# Altium schematic sheet top.SchDoc
size A4
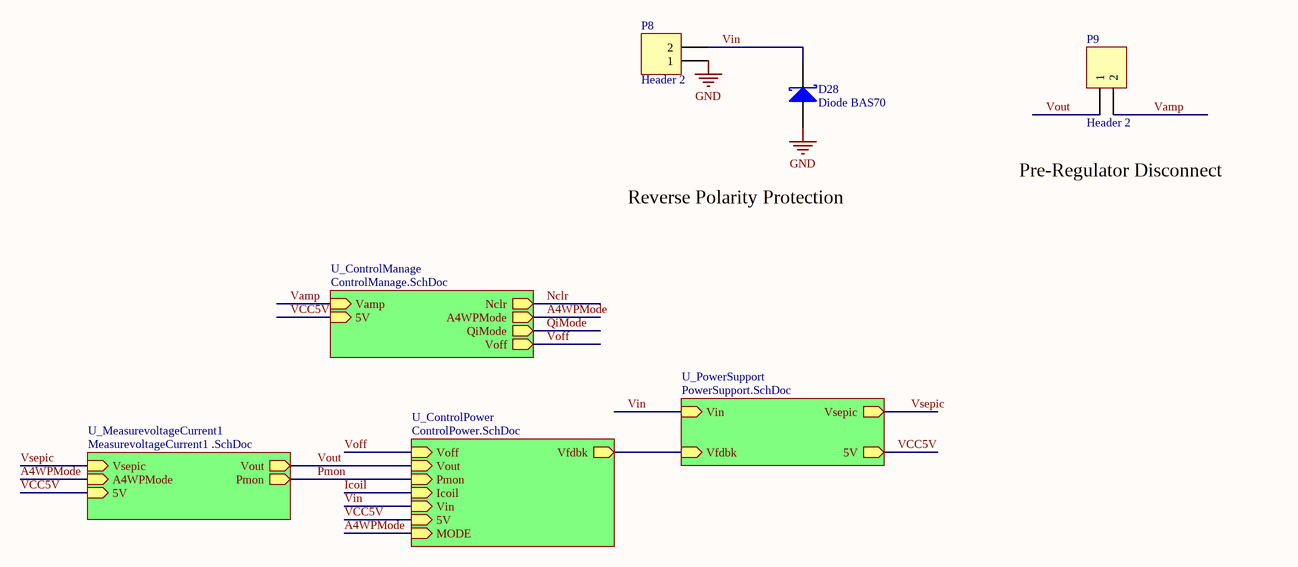
[diagram p0: top.SchDoc]

## Parts
D28  Diode BAS70  [SMA]
P8  Header 2  [HDR1X2]
P9  Header 2  [HDR1X2]

## Sub-sheets
U_ControlManage = ControlManage.SchDoc: Nclr (out), Vamp (in), A4WPMode (out), QiMode (out), 5V (in), Voff (out)
U_ControlPower = ControlPower.SchDoc: Voff (in), Vout (in), Pmon (in), Icoil (in), Vfdbk (out), Vin (in), 5V (in), MODE (in)
U_MeasurevoltageCurrent1  = MeasurevoltageCurrent1 .SchDoc: Vout (out), Vsepic (in), A4WPMode (in), Pmon (out), 5V (in)
U_PowerSupport = PowerSupport.SchDoc: Vsepic (out), 5V (out), Vin (in), Vfdbk (in)

## Nets
GND: D28.1(A) P8.1
A4WPMode: sheet U_ControlManage/A4WPMode, sheet U_ControlPower/MODE, sheet U_MeasurevoltageCurrent1 /A4WPMode
Icoil: sheet U_ControlPower/Icoil
Nclr: sheet U_ControlManage/Nclr
Pmon: sheet U_ControlPower/Pmon, sheet U_MeasurevoltageCurrent1 /Pmon
QiMode: sheet U_ControlManage/QiMode
Vamp: P9.2 ; sheet U_ControlManage/Vamp
VCC5V: sheet U_PowerSupport/5V, sheet U_ControlManage/5V, sheet U_ControlPower/5V, sheet U_MeasurevoltageCurrent1 /5V
Vin: D28.3(K) P8.2 ; sheet U_PowerSupport/Vin, sheet U_ControlPower/Vin
Voff: sheet U_ControlManage/Voff, sheet U_ControlPower/Voff
Vout: P9.1 ; sheet U_ControlPower/Vout, sheet U_MeasurevoltageCurrent1 /Vout
Vsepic: sheet U_PowerSupport/Vsepic, sheet U_MeasurevoltageCurrent1 /Vsepic
(unnamed): sheet U_PowerSupport/Vfdbk, sheet U_ControlPower/Vfdbk

## Notes on the sheet
- Pre-Regulator Disconnect
- Reverse Polarity Protection

## Library data of the parts
D28 = Diode BAS70: Silicon AF Schottky Diode for High-Speed Switching; pin to pad: 3>2; Note: Pin 2 is not connected and not drawn.; Published: 21-Mar-2003; LatestRevisionDate: 29-May-2009; LatestRevisionNote: IPC-7351 Footprint Added.; DatasheetVersion: Oct-1999; PackageVersion: Sep-2001; PackageReference: SOT-23; Publisher: Altium Limited; PackageDescription: 3-Pin SOT-23 Package 0.95 mm Pitch, 2.5 mm Lead Span; ComponentLink1Description: Manufacturer Link; ComponentLink1URL: http://www.infineon.com/; ComponentLink2Description: Datasheet; ComponentLink2URL: http://www.infineon.com/upload/Document/cmc_upload/documents/009/382/bas40_bas140series_1.pdf
P8 P9 = Header 2: Header, 2-Pin; LatestRevisionDate: 17-Jul-2002; LatestRevisionNote: Re-released for DXP Platform.; Publisher: Altium Limited